# Altium schematic sheet 0040_GPP_I_J_K_R_S.SchDoc
size A3
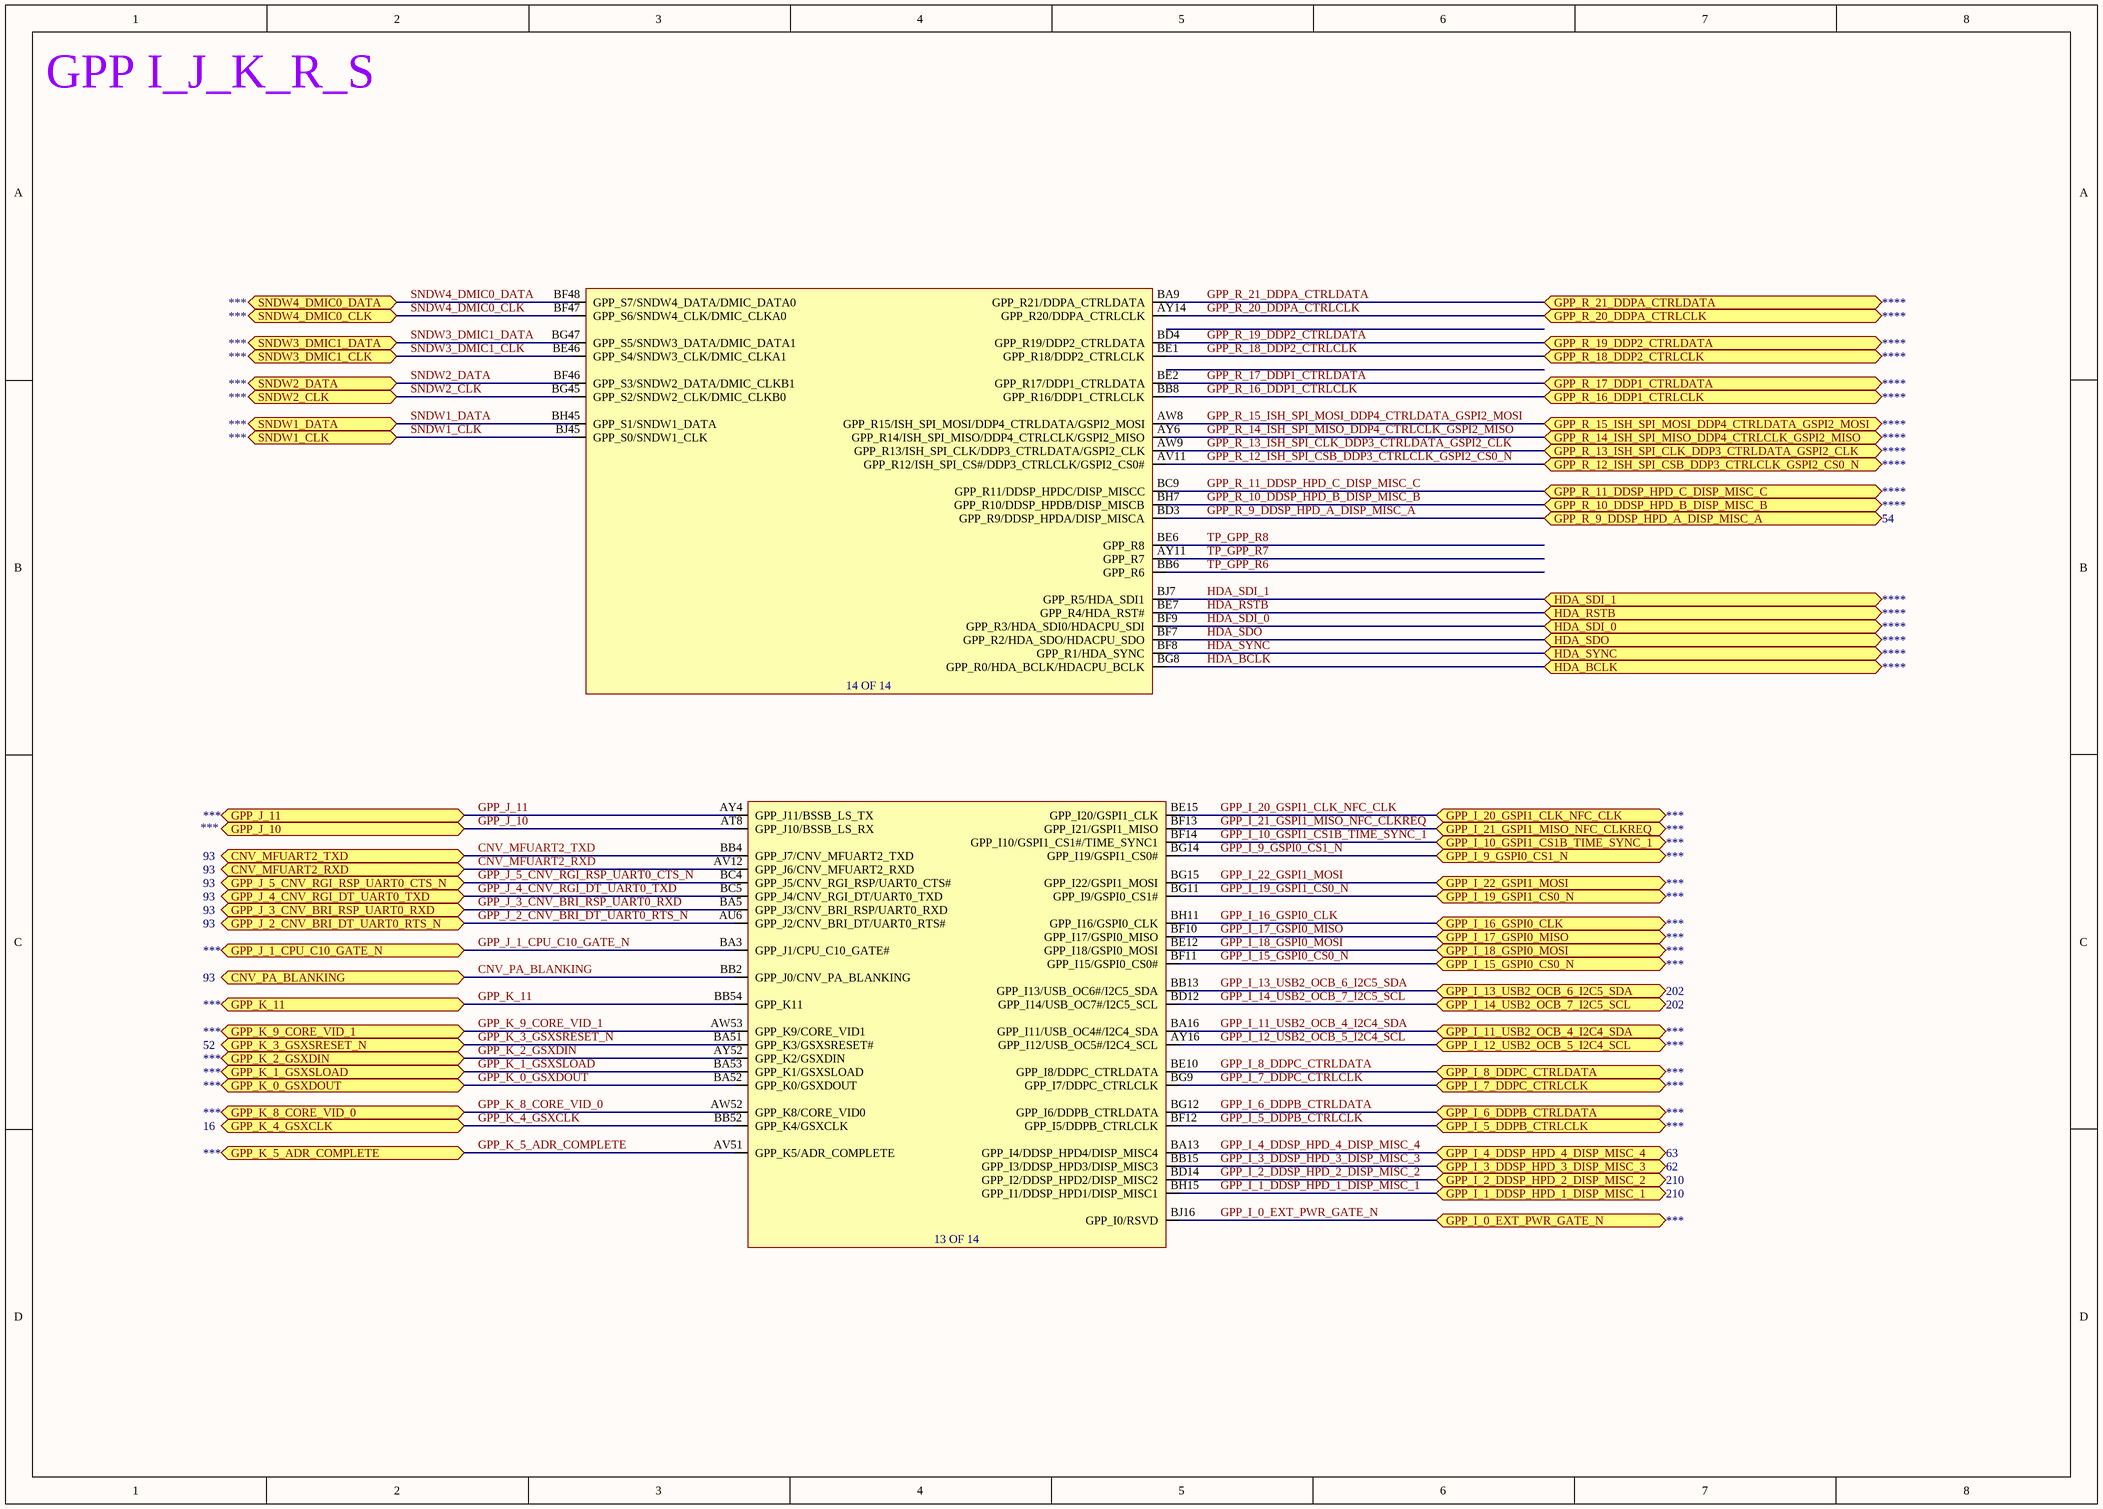
[diagram p0: 0040_GPP_I_J_K_R_S.SchDoc]

## Parts
U23601  C_RPL_S_PCH_EXT  (value not drawn)  (parts M,N of 14)

## Ports
CNV_MFUART2_RXD (bidir), CNV_MFUART2_TXD (bidir), CNV_PA_BLANKING (bidir), GPP_I_0_EXT_PWR_GATE_N (bidir), GPP_I_1_DDSP_HPD_1_DISP_MISC_1 (bidir), GPP_I_2_DDSP_HPD_2_DISP_MISC_2 (bidir), GPP_I_3_DDSP_HPD_3_DISP_MISC_3 (bidir), GPP_I_4_DDSP_HPD_4_DISP_MISC_4 (bidir), GPP_I_5_DDPB_CTRLCLK (bidir), GPP_I_6_DDPB_CTRLDATA (bidir), GPP_I_7_DDPC_CTRLCLK (bidir), GPP_I_8_DDPC_CTRLDATA (bidir), GPP_I_9_GSPI0_CS1_N (bidir), GPP_I_10_GSPI1_CS1B_TIME_SYNC_1 (bidir), GPP_I_11_USB2_OCB_4_I2C4_SDA (bidir), GPP_I_12_USB2_OCB_5_I2C4_SCL (bidir), GPP_I_13_USB2_OCB_6_I2C5_SDA (bidir), GPP_I_14_USB2_OCB_7_I2C5_SCL (bidir), GPP_I_15_GSPI0_CS0_N (bidir), GPP_I_16_GSPI0_CLK (bidir), GPP_I_17_GSPI0_MISO (bidir), GPP_I_18_GSPI0_MOSI (bidir), GPP_I_19_GSPI1_CS0_N (bidir), GPP_I_20_GSPI1_CLK_NFC_CLK (bidir), GPP_I_21_GSPI1_MISO_NFC_CLKREQ (bidir), GPP_I_22_GSPI1_MOSI (bidir), GPP_J_1_CPU_C10_GATE_N (bidir), GPP_J_2_CNV_BRI_DT_UART0_RTS_N (bidir), GPP_J_3_CNV_BRI_RSP_UART0_RXD (bidir), GPP_J_4_CNV_RGI_DT_UART0_TXD (bidir), GPP_J_5_CNV_RGI_RSP_UART0_CTS_N (bidir), GPP_J_10 (bidir), GPP_J_11 (bidir), GPP_K_0_GSXDOUT (bidir), GPP_K_1_GSXSLOAD (bidir), GPP_K_2_GSXDIN (bidir), GPP_K_3_GSXSRESET_N (bidir), GPP_K_4_GSXCLK (bidir), GPP_K_5_ADR_COMPLETE (bidir), GPP_K_8_CORE_VID_0 (bidir), GPP_K_9_CORE_VID_1 (bidir), GPP_K_11 (bidir), GPP_R_9_DDSP_HPD_A_DISP_MISC_A (bidir), GPP_R_10_DDSP_HPD_B_DISP_MISC_B (bidir), GPP_R_11_DDSP_HPD_C_DISP_MISC_C (bidir), GPP_R_12_ISH_SPI_CSB_DDP3_CTRLCLK_GSPI2_CS0_N (bidir), GPP_R_13_ISH_SPI_CLK_DDP3_CTRLDATA_GSPI2_CLK (bidir), GPP_R_14_ISH_SPI_MISO_DDP4_CTRLCLK_GSPI2_MISO (bidir), GPP_R_15_ISH_SPI_MOSI_DDP4_CTRLDATA_GSPI2_MOSI (bidir), GPP_R_16_DDP1_CTRLCLK (bidir), GPP_R_17_DDP1_CTRLDATA (bidir), GPP_R_18_DDP2_CTRLCLK (bidir), GPP_R_19_DDP2_CTRLDATA (bidir), GPP_R_20_DDPA_CTRLCLK (bidir), GPP_R_21_DDPA_CTRLDATA (bidir), HDA_BCLK (bidir), HDA_RSTB (bidir), HDA_SDI_0 (bidir), HDA_SDI_1 (bidir), HDA_SDO (bidir), HDA_SYNC (bidir), SNDW1_CLK (bidir), SNDW1_DATA (bidir), SNDW2_CLK (bidir), SNDW2_DATA (bidir), SNDW3_DMIC1_CLK (bidir), SNDW3_DMIC1_DATA (bidir), SNDW4_DMIC0_CLK (bidir), SNDW4_DMIC0_DATA (bidir)

## Nets
CNV_MFUART2_RXD: U23601.AV12(GPP_J6/CNV_MFUART2_RXD) ; port CNV_MFUART2_RXD
CNV_MFUART2_TXD: U23601.BB4(GPP_J7/CNV_MFUART2_TXD) ; port CNV_MFUART2_TXD
CNV_PA_BLANKING: U23601.BB2(GPP_J0/CNV_PA_BLANKING) ; port CNV_PA_BLANKING
GPP_I_0_EXT_PWR_GATE_N: U23601.BJ16(GPP_I0/RSVD) ; port GPP_I_0_EXT_PWR_GATE_N
GPP_I_1_DDSP_HPD_1_DISP_MISC_1: U23601.BH15(GPP_I1/DDSP_HPD1/DISP_MISC1) ; port GPP_I_1_DDSP_HPD_1_DISP_MISC_1
GPP_I_2_DDSP_HPD_2_DISP_MISC_2: U23601.BD14(GPP_I2/DDSP_HPD2/DISP_MISC2) ; port GPP_I_2_DDSP_HPD_2_DISP_MISC_2
GPP_I_3_DDSP_HPD_3_DISP_MISC_3: U23601.BB15(GPP_I3/DDSP_HPD3/DISP_MISC3) ; port GPP_I_3_DDSP_HPD_3_DISP_MISC_3
GPP_I_4_DDSP_HPD_4_DISP_MISC_4: U23601.BA13(GPP_I4/DDSP_HPD4/DISP_MISC4) ; port GPP_I_4_DDSP_HPD_4_DISP_MISC_4
GPP_I_5_DDPB_CTRLCLK: U23601.BF12(GPP_I5/DDPB_CTRLCLK) ; port GPP_I_5_DDPB_CTRLCLK
GPP_I_6_DDPB_CTRLDATA: U23601.BG12(GPP_I6/DDPB_CTRLDATA) ; port GPP_I_6_DDPB_CTRLDATA
GPP_I_7_DDPC_CTRLCLK: U23601.BG9(GPP_I7/DDPC_CTRLCLK) ; port GPP_I_7_DDPC_CTRLCLK
GPP_I_8_DDPC_CTRLDATA: U23601.BE10(GPP_I8/DDPC_CTRLDATA) ; port GPP_I_8_DDPC_CTRLDATA
GPP_I_9_GSPI0_CS1_N: U23601.BG14(GPP_I19/GSPI1_CS0#) ; port GPP_I_9_GSPI0_CS1_N
GPP_I_10_GSPI1_CS1B_TIME_SYNC_1: U23601.BF14(GPP_I10/GSPI1_CS1#/TIME_SYNC1) ; port GPP_I_10_GSPI1_CS1B_TIME_SYNC_1
GPP_I_11_USB2_OCB_4_I2C4_SDA: U23601.BA16(GPP_I11/USB_OC4#/I2C4_SDA) ; port GPP_I_11_USB2_OCB_4_I2C4_SDA
GPP_I_12_USB2_OCB_5_I2C4_SCL: U23601.AY16(GPP_I12/USB_OC5#/I2C4_SCL) ; port GPP_I_12_USB2_OCB_5_I2C4_SCL
GPP_I_13_USB2_OCB_6_I2C5_SDA: U23601.BB13(GPP_I13/USB_OC6#/I2C5_SDA) ; port GPP_I_13_USB2_OCB_6_I2C5_SDA
GPP_I_14_USB2_OCB_7_I2C5_SCL: U23601.BD12(GPP_I14/USB_OC7#/I2C5_SCL) ; port GPP_I_14_USB2_OCB_7_I2C5_SCL
GPP_I_15_GSPI0_CS0_N: U23601.BF11(GPP_I15/GSPI0_CS0#) ; port GPP_I_15_GSPI0_CS0_N
GPP_I_16_GSPI0_CLK: U23601.BH11(GPP_I16/GSPI0_CLK) ; port GPP_I_16_GSPI0_CLK
GPP_I_17_GSPI0_MISO: U23601.BF10(GPP_I17/GSPI0_MISO) ; port GPP_I_17_GSPI0_MISO
GPP_I_18_GSPI0_MOSI: U23601.BE12(GPP_I18/GSPI0_MOSI) ; port GPP_I_18_GSPI0_MOSI
GPP_I_19_GSPI1_CS0_N: U23601.BG11(GPP_I9/GSPI0_CS1#) ; port GPP_I_19_GSPI1_CS0_N
GPP_I_20_GSPI1_CLK_NFC_CLK: U23601.BE15(GPP_I20/GSPI1_CLK) ; port GPP_I_20_GSPI1_CLK_NFC_CLK
GPP_I_21_GSPI1_MISO_NFC_CLKREQ: U23601.BF13(GPP_I21/GSPI1_MISO) ; port GPP_I_21_GSPI1_MISO_NFC_CLKREQ
GPP_I_22_GSPI1_MOSI: U23601.BG15(GPP_I22/GSPI1_MOSI) ; port GPP_I_22_GSPI1_MOSI
GPP_J_1_CPU_C10_GATE_N: U23601.BA3(GPP_J1/CPU_C10_GATE#) ; port GPP_J_1_CPU_C10_GATE_N
GPP_J_2_CNV_BRI_DT_UART0_RTS_N: U23601.AU6(GPP_J2/CNV_BRI_DT/UART0_RTS#) ; port GPP_J_2_CNV_BRI_DT_UART0_RTS_N
GPP_J_3_CNV_BRI_RSP_UART0_RXD: U23601.BA5(GPP_J3/CNV_BRI_RSP/UART0_RXD) ; port GPP_J_3_CNV_BRI_RSP_UART0_RXD
GPP_J_4_CNV_RGI_DT_UART0_TXD: U23601.BC5(GPP_J4/CNV_RGI_DT/UART0_TXD) ; port GPP_J_4_CNV_RGI_DT_UART0_TXD
GPP_J_5_CNV_RGI_RSP_UART0_CTS_N: U23601.BC4(GPP_J5/CNV_RGI_RSP/UART0_CTS#) ; port GPP_J_5_CNV_RGI_RSP_UART0_CTS_N
GPP_J_10: U23601.AT8(GPP_J10/BSSB_LS_RX) ; port GPP_J_10
GPP_J_11: U23601.AY4(GPP_J11/BSSB_LS_TX) ; port GPP_J_11
GPP_K_0_GSXDOUT: U23601.BA52(GPP_K0/GSXDOUT) ; port GPP_K_0_GSXDOUT
GPP_K_1_GSXSLOAD: U23601.BA53(GPP_K1/GSXSLOAD) ; port GPP_K_1_GSXSLOAD
GPP_K_2_GSXDIN: U23601.AY52(GPP_K2/GSXDIN) ; port GPP_K_2_GSXDIN
GPP_K_3_GSXSRESET_N: U23601.BA51(GPP_K3/GSXSRESET#) ; port GPP_K_3_GSXSRESET_N
GPP_K_4_GSXCLK: U23601.BB52(GPP_K4/GSXCLK) ; port GPP_K_4_GSXCLK
GPP_K_5_ADR_COMPLETE: U23601.AV51(GPP_K5/ADR_COMPLETE) ; port GPP_K_5_ADR_COMPLETE
GPP_K_8_CORE_VID_0: U23601.AW52(GPP_K8/CORE_VID0) ; port GPP_K_8_CORE_VID_0
GPP_K_9_CORE_VID_1: U23601.AW53(GPP_K9/CORE_VID1) ; port GPP_K_9_CORE_VID_1
GPP_K_11: U23601.BB54(GPP_K11) ; port GPP_K_11
GPP_R_9_DDSP_HPD_A_DISP_MISC_A: U23601.BD3(GPP_R9/DDSP_HPDA/DISP_MISCA) ; port GPP_R_9_DDSP_HPD_A_DISP_MISC_A
GPP_R_10_DDSP_HPD_B_DISP_MISC_B: U23601.BH7(GPP_R10/DDSP_HPDB/DISP_MISCB) ; port GPP_R_10_DDSP_HPD_B_DISP_MISC_B
GPP_R_11_DDSP_HPD_C_DISP_MISC_C: U23601.BC9(GPP_R11/DDSP_HPDC/DISP_MISCC) ; port GPP_R_11_DDSP_HPD_C_DISP_MISC_C
GPP_R_12_ISH_SPI_CSB_DDP3_CTRLCLK_GSPI2_CS0_N: U23601.AV11(GPP_R12/ISH_SPI_CS#/DDP3_CTRLCLK/GSPI2_CS0#) ; port GPP_R_12_ISH_SPI_CSB_DDP3_CTRLCLK_GSPI2_CS0_N
GPP_R_13_ISH_SPI_CLK_DDP3_CTRLDATA_GSPI2_CLK: U23601.AW9(GPP_R13/ISH_SPI_CLK/DDP3_CTRLDATA/GSPI2_CLK) ; port GPP_R_13_ISH_SPI_CLK_DDP3_CTRLDATA_GSPI2_CLK
GPP_R_14_ISH_SPI_MISO_DDP4_CTRLCLK_GSPI2_MISO: U23601.AY6(GPP_R14/ISH_SPI_MISO/DDP4_CTRLCLK/GSPI2_MISO) ; port GPP_R_14_ISH_SPI_MISO_DDP4_CTRLCLK_GSPI2_MISO
GPP_R_15_ISH_SPI_MOSI_DDP4_CTRLDATA_GSPI2_MOSI: U23601.AW8(GPP_R15/ISH_SPI_MOSI/DDP4_CTRLDATA/GSPI2_MOSI) ; port GPP_R_15_ISH_SPI_MOSI_DDP4_CTRLDATA_GSPI2_MOSI
GPP_R_16_DDP1_CTRLCLK: U23601.BB8(GPP_R16/DDP1_CTRLCLK) ; port GPP_R_16_DDP1_CTRLCLK
GPP_R_17_DDP1_CTRLDATA: U23601.BE2(GPP_R17/DDP1_CTRLDATA) ; port GPP_R_17_DDP1_CTRLDATA
GPP_R_18_DDP2_CTRLCLK: U23601.BE1(GPP_R18/DDP2_CTRLCLK) ; port GPP_R_18_DDP2_CTRLCLK
GPP_R_19_DDP2_CTRLDATA: U23601.BD4(GPP_R19/DDP2_CTRLDATA) ; port GPP_R_19_DDP2_CTRLDATA
GPP_R_20_DDPA_CTRLCLK: U23601.AY14(GPP_R20/DDPA_CTRLCLK) ; port GPP_R_20_DDPA_CTRLCLK
GPP_R_21_DDPA_CTRLDATA: U23601.BA9(GPP_R21/DDPA_CTRLDATA) ; port GPP_R_21_DDPA_CTRLDATA
HDA_BCLK: U23601.BG8(GPP_R0/HDA_BCLK/HDACPU_BCLK) ; port HDA_BCLK
HDA_RSTB: U23601.BE7(GPP_R4/HDA_RST#) ; port HDA_RSTB
HDA_SDI_0: U23601.BF9(GPP_R3/HDA_SDI0/HDACPU_SDI) ; port HDA_SDI_0
HDA_SDI_1: U23601.BJ7(GPP_R5/HDA_SDI1) ; port HDA_SDI_1
HDA_SDO: U23601.BF7(GPP_R2/HDA_SDO/HDACPU_SDO) ; port HDA_SDO
HDA_SYNC: U23601.BF8(GPP_R1/HDA_SYNC) ; port HDA_SYNC
SNDW1_CLK: U23601.BJ45(GPP_S0/SNDW1_CLK) ; port SNDW1_CLK
SNDW1_DATA: U23601.BH45(GPP_S1/SNDW1_DATA) ; port SNDW1_DATA
SNDW2_CLK: U23601.BG45(GPP_S2/SNDW2_CLK/DMIC_CLKB0) ; port SNDW2_CLK
SNDW2_DATA: U23601.BF46(GPP_S3/SNDW2_DATA/DMIC_CLKB1) ; port SNDW2_DATA
SNDW3_DMIC1_CLK: U23601.BE46(GPP_S4/SNDW3_CLK/DMIC_CLKA1) ; port SNDW3_DMIC1_CLK
SNDW3_DMIC1_DATA: U23601.BG47(GPP_S5/SNDW3_DATA/DMIC_DATA1) ; port SNDW3_DMIC1_DATA
SNDW4_DMIC0_CLK: U23601.BF47(GPP_S6/SNDW4_CLK/DMIC_CLKA0) ; port SNDW4_DMIC0_CLK
SNDW4_DMIC0_DATA: U23601.BF48(GPP_S7/SNDW4_DATA/DMIC_DATA0) ; port SNDW4_DMIC0_DATA
TP_GPP_R6: U23601.BB6(GPP_R6)
TP_GPP_R7: U23601.AY11(GPP_R7)
TP_GPP_R8: U23601.BE6(GPP_R8)

## Notes on the sheet
- GPP I_J_K_R_S
- (in symbol C_RPL_S_PCH_EXT, part M) 13 OF 14
- (in symbol C_RPL_S_PCH_EXT, part N) 14 OF 14

## Library data of the parts
U23601 = C_RPL_S_PCH_EXT: Manufacturer Part Number: *; Case/Package: *